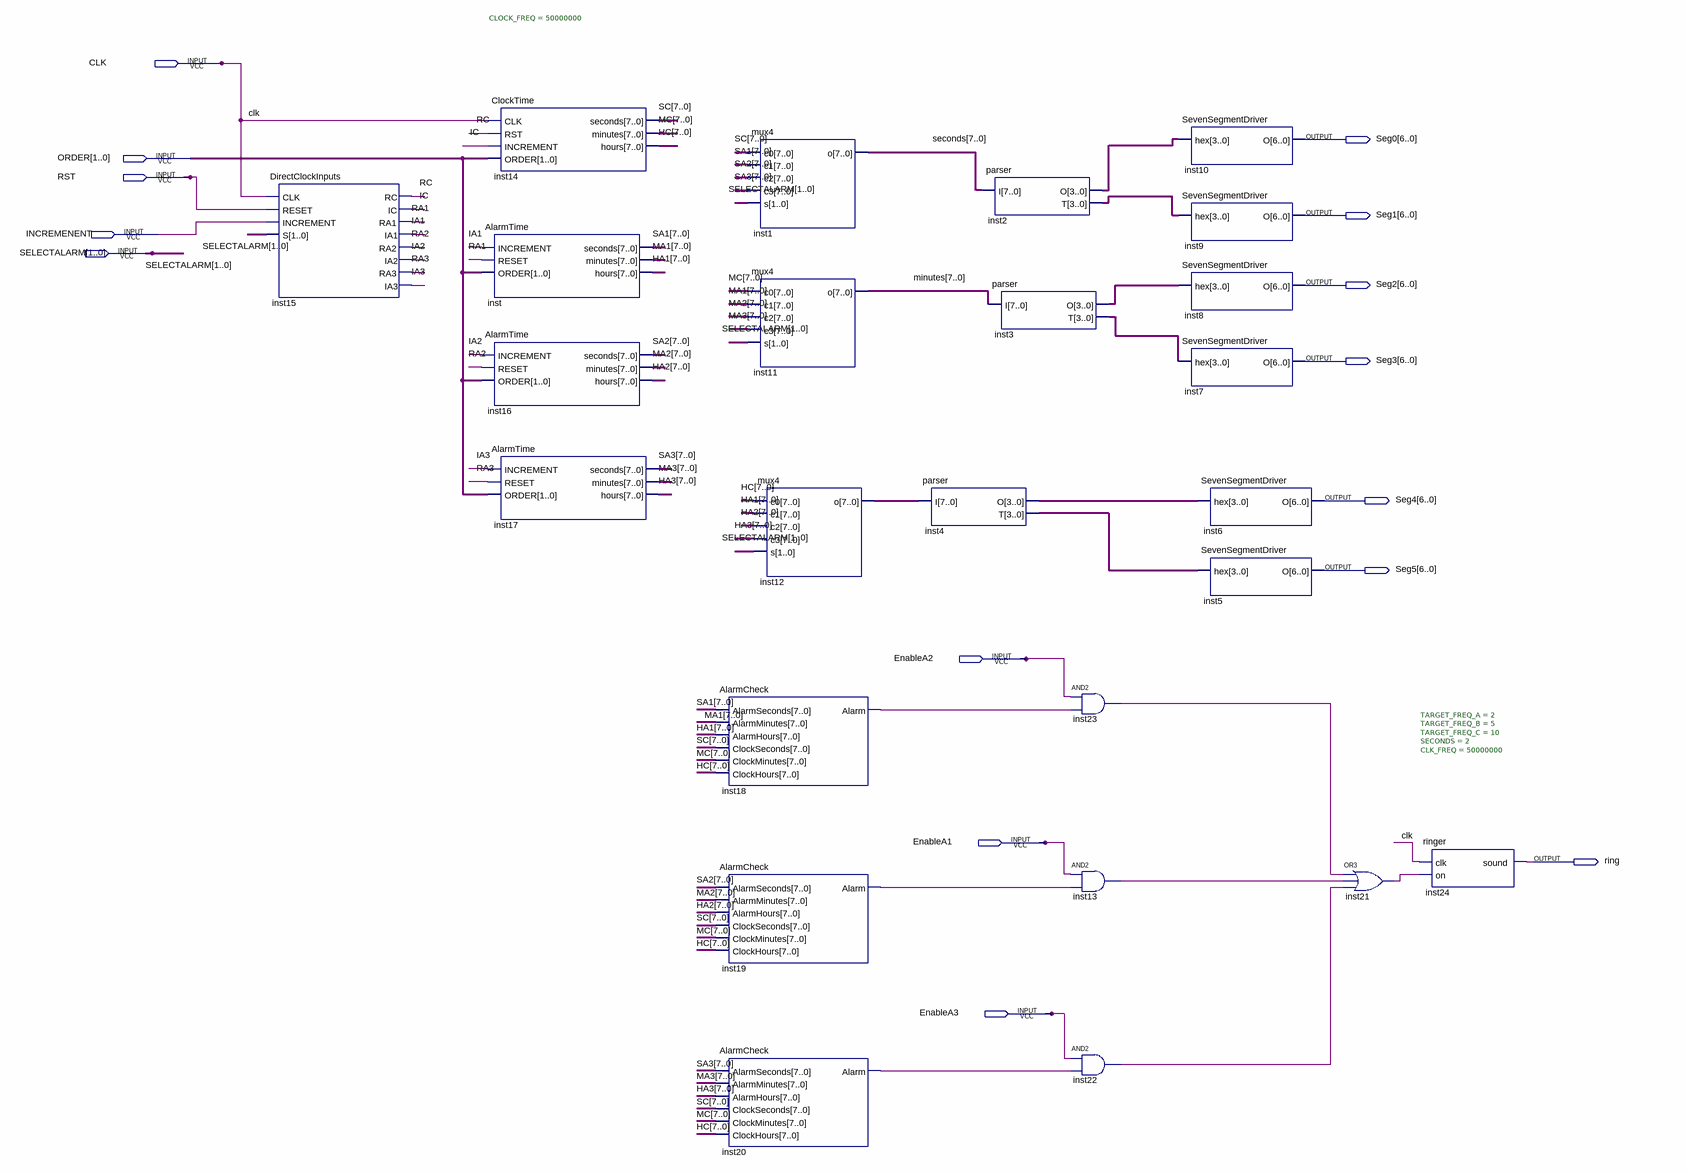
[diagram p0: schematic sheet]
// Quartus schematic DesignProject2.bdf as structural Verilog: 25 symbols, 15 pins
module DesignProject2 (
  input  CLK,
  input  [1:0] ORDER,
  input  RST,
  input  INCREMENENT,
  input  [1:0] SELECTALARM,
  input  EnableA2,
  input  EnableA1,
  input  EnableA3,
  output [6:0] Seg0,
  output [6:0] Seg1,
  output [6:0] Seg2,
  output [6:0] Seg3,
  output [6:0] Seg4,
  output [6:0] Seg5,
  output ring
);

  wire IA1, IA2, IA3, IC, inst13_out, inst18_alarm, inst19_alarm, inst20_alarm, inst21_out, inst22_out,
       inst23_out, RA1, RA2, RA3, RC;
  wire [3:0] inst2_o, inst2_t, inst3_o, inst3_t, inst4_o, inst4_t;
  wire [7:0] HA1, HA2, HA3, HC, inst12_o, MA1, MA2, MA3, MC, minutes, SA1, SA2, SA3, SC, seconds;

  DirectClockInputs inst15 (
    .CLK(CLK), .RESET(RST), .INCREMENT(INCREMENENT), .S(SELECTALARM), .RC(RC), .IC(IC), .RA1(RA1), .IA1(IA1),
    .RA2(RA2), .IA2(IA2), .RA3(RA3), .IA3(IA3));
  ClockTime #(.CLOCK_FREQ(50000000)) inst14 (
    .CLK(CLK), .RST(RC), .INCREMENT(IC), .ORDER(ORDER), .seconds(SC), .minutes(MC), .hours(HC));
  AlarmTime inst (.INCREMENT(IA1), .RESET(RA1), .ORDER(ORDER), .seconds(SA1), .minutes(MA1), .hours(HA1));
  AlarmTime inst16 (.INCREMENT(IA2), .RESET(RA2), .ORDER(ORDER), .seconds(SA2), .minutes(MA2), .hours(HA2));
  AlarmTime inst17 (.INCREMENT(IA3), .RESET(RA3), .ORDER(ORDER), .seconds(SA3), .minutes(MA3), .hours(HA3));
  mux4 inst1 (.c0(SC), .c1(SA1), .c2(SA2), .c3(SA3), .s(SELECTALARM), .o(seconds));
  mux4 inst11 (.c0(MC), .c1(MA1), .c2(MA2), .c3(MA3), .s(SELECTALARM), .o(minutes));
  AlarmCheck inst18 (
    .AlarmSeconds(SA1), .AlarmMinutes(MA1), .AlarmHours(HA1), .ClockSeconds(SC), .ClockMinutes(MC),
    .ClockHours(HC), .Alarm(inst18_alarm));
  AlarmCheck inst19 (
    .AlarmSeconds(SA2), .AlarmMinutes(MA2), .AlarmHours(HA2), .ClockSeconds(SC), .ClockMinutes(MC),
    .ClockHours(HC), .Alarm(inst19_alarm));
  AlarmCheck inst20 (
    .AlarmSeconds(SA3), .AlarmMinutes(MA3), .AlarmHours(HA3), .ClockSeconds(SC), .ClockMinutes(MC),
    .ClockHours(HC), .Alarm(inst20_alarm));
  mux4 inst12 (.c0(HC), .c1(HA1), .c2(HA2), .c3(HA3), .s(SELECTALARM), .o(inst12_o));
  parser inst4 (.I(inst12_o), .O(inst4_o), .T(inst4_t));
  parser inst2 (.I(seconds), .O(inst2_o), .T(inst2_t));
  parser inst3 (.I(minutes), .O(inst3_o), .T(inst3_t));
  and inst23 (inst23_out, EnableA2, inst18_alarm);
  and inst13 (inst13_out, EnableA1, inst19_alarm);
  and inst22 (inst22_out, EnableA3, inst20_alarm);
  SevenSegmentDriver inst10 (.hex(inst2_o), .O(Seg0));
  SevenSegmentDriver inst9 (.hex(inst2_t), .O(Seg1));
  SevenSegmentDriver inst8 (.hex(inst3_o), .O(Seg2));
  SevenSegmentDriver inst7 (.hex(inst3_t), .O(Seg3));
  SevenSegmentDriver inst6 (.hex(inst4_o), .O(Seg4));
  SevenSegmentDriver inst5 (.hex(inst4_t), .O(Seg5));
  or inst21 (inst21_out, inst23_out, inst13_out, inst22_out);
  ringer #(.TARGET_FREQ_A(2), .TARGET_FREQ_B(5), .TARGET_FREQ_C(10), .SECONDS(2), .CLK_FREQ(50000000)) inst24 (
    .clk(CLK), .on(inst21_out), .sound(ring));
endmodule
